# Altium schematic sheet Sche_CB.SchDoc
size 420 x 297 mm; SheetNumber: 1; SheetTotal: 1
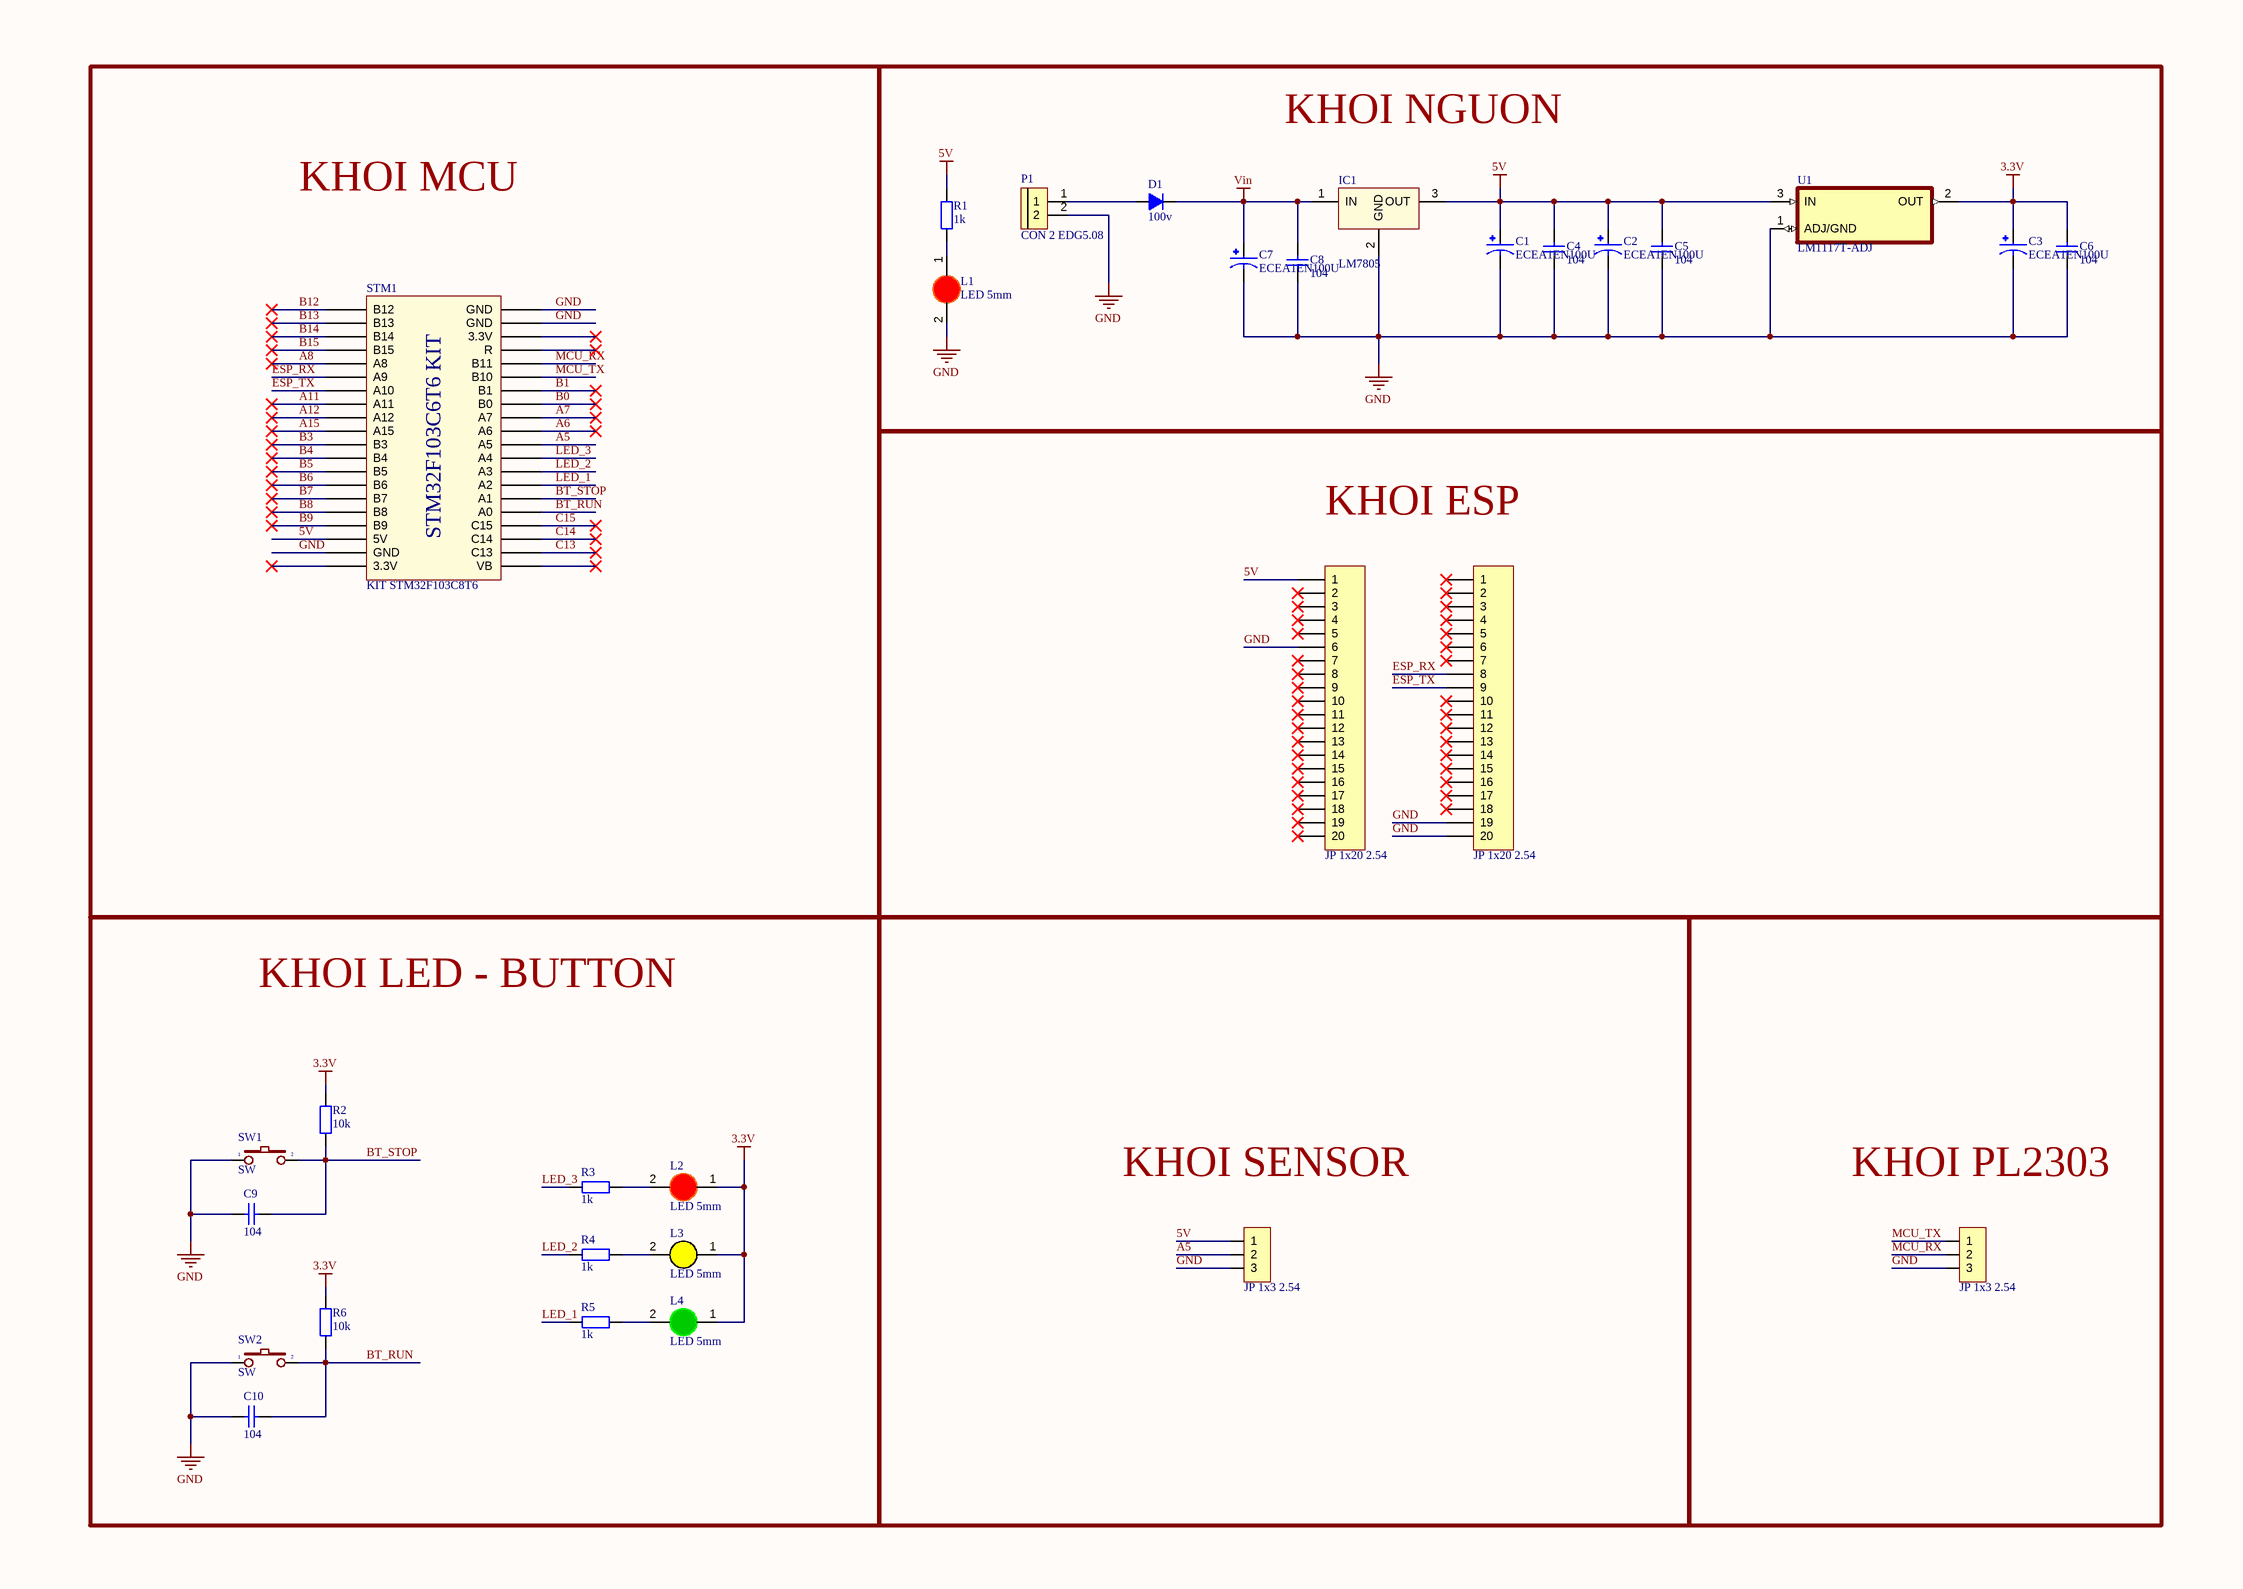
[diagram p0: Sche_CB.SchDoc]

## Parts
C1  ECEA1EN100U  [CAPPRD200W50D500H1100]
C2  ECEA1EN100U  [CAPPRD200W50D500H1100]
C3  ECEA1EN100U  [CAPPRD200W50D500H1100]
C4  104  [tu gom]
C5  104  [tu gom]
C6  104  [tu gom]
C7  ECEA1EN100U  [CAPPRD200W50D500H1100]
C8  104  [tu gom]
C9  104  [tu gom]
C10  104  [tu gom]
D1  100v  [DIODE 1A]
IC1  LM7805  [QTO-220]
JP1  JP 1x20 2.54  [JP 1x20 CT]
JP2  JP 1x20 2.54  [JP 1x20 CT]
JP3  JP 1x3 2.54  [JP 1x3 CT]
JP4  JP 1x3 2.54  [JP 1x3 CT]
L1  LED 5mm  [LED-5MM-RED]
L2  LED 5mm  [LED-5MM-RED]
L3  LED 5mm  [LED-5MM-Yellow]
L4  LED 5mm  [LED-5MM-Green]
P1  CON 2 EDG5.08  [CON 2 2EDG5.08]
R1  1k  [tro vach 1/4w]
R2  10k  [tro vach 1/4w]
R3  1k  [tro vach 1/4w]
R4  1k  [tro vach 1/4w]
R5  1k  [tro vach 1/4w]
R6  10k  [tro vach 1/4w]
STM1  KIT STM32F103C8T6  [STM32F103 KIT]
SW1  SW  [SW2]
SW2  SW  [SW2]
U1  LM1117T-ADJ  [TO254P1054X470X1955-3]

## Blocks framed on the sheet
KHOI MCU: STM1
KHOI NGUON: C1-C8 D1 IC1 L1 P1 R1 U1
KHOI ESP: JP1 JP2
KHOI LED - BUTTON: C9 C10 L2-L4 R2-R6 SW1 SW2
KHOI SENSOR: JP3
KHOI PL2303: JP4

## Nets
3.3V: C3.P C6.1 L2.1(A) L3.1(A) L4.1(A) R2.2 R6.2 U1.2(OUT)
5V: C1.P C2.P C4.1 C5.1 IC1.3(OUT) JP1.1 JP3.1 R1.2 STM1.18(5V) U1.3(IN)
GND: C1.N C2.N C3.N C4.2 C5.2 C6.2 C7.N C8.2 C9.2 C10.2 IC1.2(GND) JP1.6 JP2.19 JP2.20 JP3.3 JP4.3 L1.2(K) P1.2 STM1.19(GND) STM1.39(GND) STM1.40(GND) SW1.1 SW2.1 U1.1(ADJ/GND)
Vin: C7.P C8.1 D1.2(K) IC1.1(IN)
A5: JP3.2 STM1.30(A5)
A6: STM1.31(A6)
A7: STM1.32(A7)
A8: STM1.5(A8)
A11: STM1.8(A11)
A12: STM1.9(A12)
A15: STM1.10(A15)
B0: STM1.33(B0)
B1: STM1.34(B1)
B3: STM1.11(B3)
B4: STM1.12(B4)
B5: STM1.13(B5)
B6: STM1.14(B6)
B7: STM1.15(B7)
B8: STM1.16(B8)
B9: STM1.17(B9)
B12: STM1.1(B12)
B13: STM1.2(B13)
B14: STM1.3(B14)
B15: STM1.4(B15)
BT_RUN: C10.1 R6.1 STM1.25(A0) SW2.2
BT_STOP: C9.1 R2.1 STM1.26(A1) SW1.2
C13: STM1.22(C13)
C14: STM1.23(C14)
C15: STM1.24(C15)
ESP_RX: JP2.8 STM1.6(A9)
ESP_TX: JP2.9 STM1.7(A10)
LED_1: R5.1 STM1.27(A2)
LED_2: R4.1 STM1.28(A3)
LED_3: R3.1 STM1.29(A4)
MCU_RX: JP4.2 STM1.36(B11)
MCU_TX: JP4.1 STM1.35(B10)
NetD1_1: D1.1(A) P1.1
NetL1_1: L1.1(A) R1.1
NetL2_2: L2.2(K) R3.2
NetL3_2: L3.2(K) R4.2
NetL4_2: L4.2(K) R5.2

Not connected (* = marked no-connect by the designer): JP1 2* 3* 4* 5* 7* 8* 9* 10* 11* 12* 13* 14* 15* 16* 17* 18* 19* 20*; JP2 1* 2* 3* 4* 5* 6* 7* 10* 11* 12* 13* 14* 15* 16* 17* 18*; STM1 20(3.3V)* 21(VB)* 37(R)* 38(3.3V)*

## Notes on the sheet
- THIS DOCUMENT AND THE DATA DISCLOSED HEREIN OR
- HEREWITH IS THE PROPERTY OF ALTIUM LIMITED AND MAY
- DWG NO:
- REVISION
- REV:
- DESCRIPTION
- DATE
- APPROVED
- BE FREELY DISTRIBUTED IN WHOLE. NO RIGHTS ARE
- RESERVED OR EXPRESS OR IMPLIED WARANTEE GIVEN.
- ENG:
- APPROVALS
- PROJECT
- DSN:
- CHK:
- REFERENCE DOCUMENTS
- PROJECT REVISION:
- TITLE
- DOCUMENT REVISION:
- DESIGN ITEM:
- BOM:
- FAB DWG:
- PCB DWG:
- ASSY DWG:
- SCALE:
- A3
- SIZE
- CAGE CODE
- FILE NAME
- DWG NO.
- SHEET
- OF
- REV
- (in symbol STM32f103 Bluepill) STM32F103C6T6 KIT

## Library data of the parts
C1-C3 C7 = ECEA1EN100U: 10ÂµF 25V Aluminum Electrolytic Capacitors Radial, Can 2000 Hrs @ 85Â°C; MF: Panasonic; Price: None; Check_prices: https://www.snapeda.com/parts/ECEA1EN100U/Panasonic/view-part/?ref=eda; Package: RADIAL-2 Panasonic; SnapEDA_Link: https://www.snapeda.com/parts/ECEA1EN100U/Panasonic/view-part/?ref=snap; Value: *; MP: ECEA1EN100U; Availability: In Stock
C4-C6 C8-C10 = Tu gom 104 50V: Cắm; So_Chan: 2; Ten_Linh_Kien: Tụ gốm 104 100nF 50V; Don_Vi: Con; Ma_Hang: MH004761; Chung_Loai: Cắm; Kieu_Chan: *
D1 = Diode 1N4007: Cắm; Ten_Linh_Kien: Diode 1N4007 1A (DIP); Don_Vi: Con; Ma_Hang: MH001063; Ghi Chu: *; Kieu_Chan: *; Chung_Loai: Cắm
IC1 = LM78xx: On ap +, from + 5 to + 24VDC; Value: LM7805
JP1 JP2 = JP 1x20 2.54 Cai Thang: Cắm; Ten_Linh_Kien: Jump Đơn Cái 2.54MM 1x20P Thẳng; Don_Vi: Con; Ma_Hang: MH004006; Ghi_Chu: *; Kieu_Chan: *; Chung_Loai: Cắm
JP3 JP4 = JP 1x3 2.54 Cai Thang: Cắm; Ten_Linh_Kien: Jump Đơn Cái 2.54MM 1x20P Thẳng; Don_Vi: Con; Ma_Hang: MH004006; Ghi_Chu: *; Kieu_Chan: *; Chung_Loai: Cắm
L1 L2 = LED 5mm Do: Cắm; Don_Vi: Con; Ma_Hang: MH008967; Ten_Linh_Kien: Led 5MM Phủ Đỏ (1000c); Ghi_Chu: *; Kieu_Chan: *; Chung_Loai: Cắm
L3 = LED 5mm Vang: Cắm; Don_Vi: Con; Ma_Hang: MH008968; Ten_Linh_Kien: Led 5MM Phủ Vàng (1000c); Ghi_Chu: *; Kieu_Chan: *; Chung_Loai: Cắm
L4 = LED 5mm Xanh La: Cắm; Don_Vi: Con; Ma_Hang: MH008969; Ten_Linh_Kien: LED 5MM Phủ Xanh (1000c); Ghi_Chu: *; Kieu_Chan: *; Chung_Loai: Cắm
P1 = CON 2 EDG5.08: Cắm; Ten_Linh_Kien: CON 2 2EDG5.08-2P 5.08MM ( Xanh Cong); Ma_Hang: MH000759; Ghi_Chu: *; Don_Vi: Con; Kieu_Chan: *; Chung_Loai: Cắm
R1 = Tro Vach 1/4W 5% 1k: Cắm; Don_Vi: Con; So_Chan: 2; Ten_Linh_Kien: Trở Vạch 1/4w 5% 1k; Ma_Hang: MH007390; Chung_Loai: Cắm; Kieu_Chan: *
R2 R6 = Tro Vach 1/4W 1% 10k: Cắm; Don_Vi: Con; So_Chan: 2; Ten_Linh_Kien: Trở Vạch 1/4w 1% 10k; Ma_Hang: MH006349; Chung_Loai: Cắm; Kieu_Chan: *
R3-R5 = Tro Vach 1/4W 1% 4.7k: Cắm; Don_Vi: Con; So_Chan: 2; Ten_Linh_Kien: Trở Vạch 1/4w 1% 4.7k; Ma_Hang: MH006350; Chung_Loai: Cắm; Kieu_Chan: *
STM1 = STM32f103 Bluepill: KIT STM32F103C8T6 Bluepill
SW1 SW2 = SW2: Switch button 2 pin; Value: SW chip 2 pin
U1 = LM1117T-ADJ: 800-mA 15-V linear voltage regulator; MF: Texas Instruments; MP: LM1117T-ADJ/NOPB; SnapEDA_Link: https://www.snapeda.com/parts/LM1117T-ADJ/NOPB/Texas+Instruments/view-part/?ref=snap; Package: TO-220-3 Texas Instruments; Value: *; Check_prices: https://www.snapeda.com/parts/LM1117T-ADJ/NOPB/Texas+Instruments/view-part/?ref=eda